# Altium schematic sheet Sheet2.SchDoc
size 420 x 297 mm; SheetNumber: 1; SheetTotal: 2; Razrabotal: {Разработал}; Prov: {Проверил}; Tkont: {Т. конт.}; Nkont: {Н. конт.}; Utv: {Утвердил}; Naimenovanie: {Наименование}; Oboznachenie: {Обозначение}; Shifr: {Шифр}
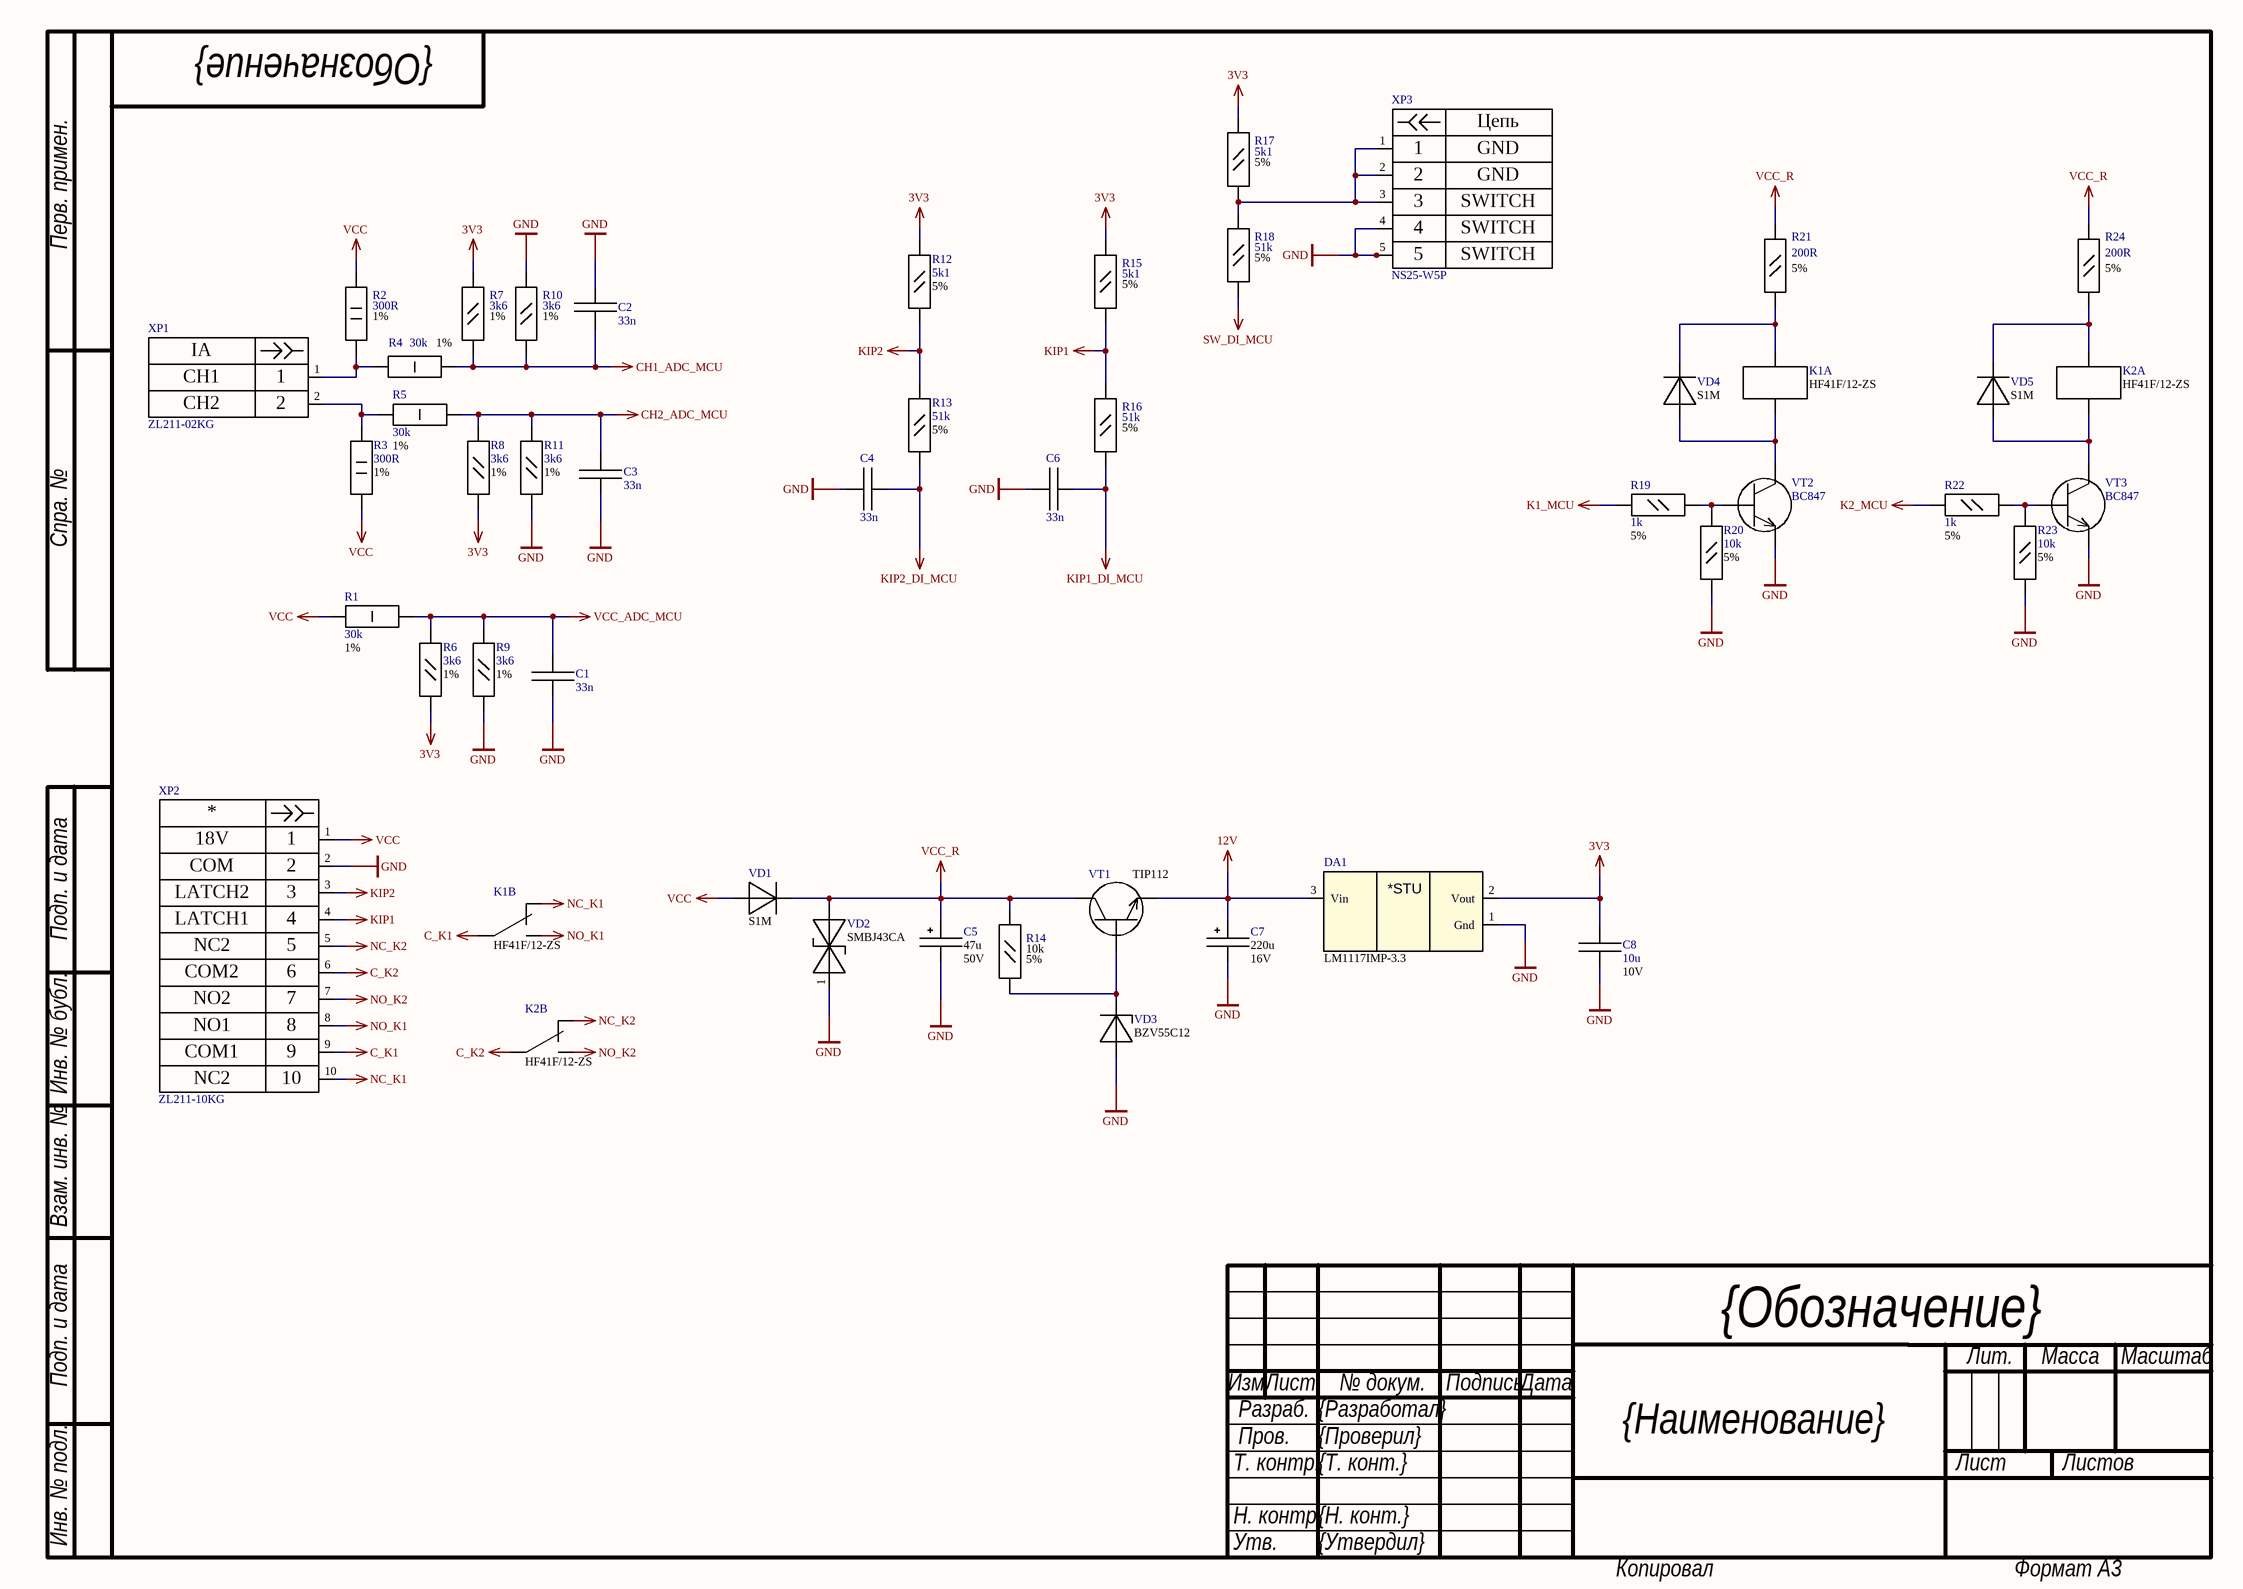
[diagram p0: Sheet2.SchDoc]

## Parts
C1  33n  [Cap Ceramic 0805]
C2  33n  [Cap Ceramic 0805]
C3  33n  [Cap Ceramic 0805]
C4  33n  [Cap Ceramic 0805]
C5  47u  Comments: 50V  [Cap electro d6.3x2.54mm]
C6  33n  [Cap Ceramic 0805]
C7  220u  Comments: 16V  [Cap electro d6.3x2.54mm]
C8  10u  Comments: 10V  [Cap Ceramic 1206]
DA1  LM1117IMP-3.3  [SOT-232]
K1  HF41F/12-ZS  [RM699V]  (parts A,B of 2)
K2  HF41F/12-ZS  [RM699V]  (parts A,B of 2)
R1  30k  Comments: 1%  [Resistor 2512]
R2  300R  Comments: 1%  [Resistor 2W d5.08x20.32 axial]
R3  300R  Comments: 1%  [Resistor 2W d5.08x20.32 axial]
R4  30k  Comments: 1%  [Resistor 2512]
R5  30k  Comments: 1%  [Resistor 2512]
R6  3k6  Comments: 1%  [Resistor 0805]
R7  3k6  Comments: 1%  [Resistor 0805]
R8  3k6  Comments: 1%  [Resistor 0805]
R9  3k6  Comments: 1%  [Resistor 0805]
R10  3k6  Comments: 1%  [Resistor 0805]
R11  3k6  Comments: 1%  [Resistor 0805]
R12  5k1  Comments: 5%  [Resistor 0805]
R13  51k  Comments: 5%  [Resistor 0805]
R14  10k  Comments: 5%  [Resistor 0805]
R15  5k1  Comments: 5%  [Resistor 0805]
R16  51k  Comments: 5%  [Resistor 0805]
R17  5k1  Comments: 5%  [Resistor 0805]
R18  51k  Comments: 5%  [Resistor 0805]
R19  1k  Comments: 5%  [Resistor 0805]
R20  10k  Comments: 5%  [Resistor 0805]
R21  200R  Comments: 5%  [Resistor 0805]
R22  1k  Comments: 5%  [Resistor 0805]
R23  10k  Comments: 5%  [Resistor 0805]
R24  200R  Comments: 5%  [Resistor 0805]
VD1  S1M  [DO-214AC SMA]
VD2  SMBJ43CA  [DO-214AA SMB]
VD3  BZV55C12  [SOD80C]
VD4  S1M  [DO-214AC SMA]
VD5  S1M  [DO-214AC SMA]
VT1  TIP112  [TO-220]
VT2  BC847  [SOT-23-3]
VT3  BC847  [SOT-23-3]
XP1  ZL211-02KG  Name1: CH1  Name: IA  Name2: CH2  [Pins 1x2]
XP2  ZL211-10KG  Name1: 18V  Name2: COM  Name3: LATCH2  Name4: LATCH1  Name5: NC2  Name6: COM2  Name7: NO2  Name8: NO1  Name9: COM1  [Pins 1x10]
XP3  NS25-W5P  Name1: GND  Name: Цепь  Name3: SWITCH  [WF-05]

## Nets
3V3: C8.2 DA1.2(Vout) R6.1 R7.1 R8.1 R12.1 R15.1 R17.1
12V: C7.2 DA1.3(Vin) VT1.3(E)
C_K1: K1.11 XP2.9
C_K2: K2.11 XP2.6
CH1_ADC_MCU: C2.2 R4.2 R7.2 R10.2
CH2_ADC_MCU: C3.2 R5.2 R8.2 R11.2
GND: C1.1 C2.1 C3.1 C4.2 C5.1 C6.2 C7.1 C8.1 DA1.1(Gnd) R9.1 R10.1 R11.1 R20.2 R23.2 VD2.1 VD3.1(A) VT2.2(E) VT3.2(E) XP2.2 XP3.4 XP3.5
K1_MCU: R19.2
K2_MCU: R22.2
KIP1: R15.2 R16.1 XP2.4
KIP1_DI_MCU: C6.1 R16.2
KIP2: R12.2 R13.1 XP2.3
KIP2_DI_MCU: C4.1 R13.2
NC_K1: K1.12 XP2.10
NC_K2: K2.12 XP2.5
NO_K1: K1.14 XP2.8
NO_K2: K2.14 XP2.7
SW_DI_MCU: R18.2
VCC: R1.1 R2.2 R3.2 VD1.1(A) XP2.1
VCC_ADC_MCU: C1.2 R1.2 R6.2 R9.2
VCC_R: C5.2 R14.1 R21.2 R24.2 VD1.2(K) VD2.2 VT1.2(K)
NetK1_1: K1.1 R21.1 VD4.2(K)
NetK1_2: K1.2 VD4.1(A) VT2.3(K)
NetK2_1: K2.1 R24.1 VD5.2(K)
NetK2_2: K2.2 VD5.1(A) VT3.3(K)
NetR2_1: R2.1 R4.1 XP1.1
NetR3_1: R3.1 R5.1 XP1.2
NetR14_2: R14.2 VD3.2(K) VT1.1(B)
NetR17_2: R17.2 R18.1 XP3.1 XP3.2 XP3.3
NetR19_1: R19.1 R20.1 VT2.1(B)
NetR22_1: R22.1 R23.1 VT3.1(B)

## Notes on the sheet
- Перв. примен.
- Спра. №
- Подп. и дата
- Инв. № бубл.
- Взам. инв. №
- Изм
- Лист
- № докум.
- Подпись
- Дата
- Лит.
- Масса
- Масштаб
- Т. контр.
- Разраб.
- Пров.
- Листов
- Инв. № подл.
- Н. контр.
- Утв.
- Копировал
- Формат А3
- (in symbol LM1117IMP-x.x) *STU

## Library data of the parts
C1-C4 C6 C8 = CerCap
  C1-C4 C6: Comments: *
C5 C7 = ECap
DA1 = LM1117IMP-x.x: Comments: *
K1 K2 = RM699V-xx11-85-xxxx: Comments: *
R1 R4 R5 = Resistor 1W
R2 R3 = Resistor 2W
R6-R24 = Resistor 0,125W
VD2 = SMBJxxCA: Comments: *
VD3 = BZV55Cxx: Comments: *
VT1 = BDW93C
XP1 = Pins 1x2: Comments: *
XP2 = Pins 1x10: Comments: *; Name: *; Name10: NC2
XP3 = Pins 1x5: Comments: *; Name2: GND; Name4: SWITCH; Name5: SWITCH
VD1 VD4 VD5 = S1M: Comments: *
VT2 VT3 = BC847: Comments: *